# Altium schematic sheet Light Sensor Node.SchDoc
size A4
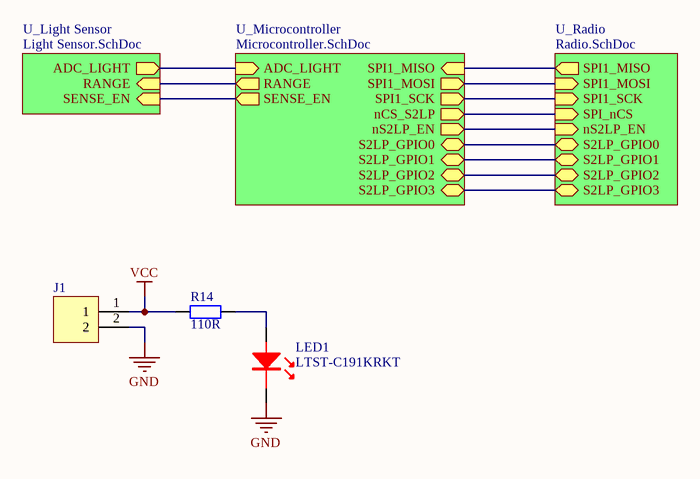
[diagram p0: Light Sensor Node.SchDoc]

## Parts
J1  22-05-3021  [MOLEX_22-05-3021]  (value not drawn)
LED1  LTST-C191KRKT  [LITEON_LTST-C191KRKT]
R14  110R  [R0603]

## Sub-sheets
U_Light Sensor = Light Sensor.SchDoc: ADC_LIGHT (out), RANGE (in), SENSE_EN (in)
U_Microcontroller = Microcontroller.SchDoc: ADC_LIGHT (in), RANGE (out), SPI1_SCK (out), SPI1_MISO (in), SPI1_MOSI (out), nCS_S2LP (out), nS2LP_EN (out), SENSE_EN (out), S2LP_GPIO2 (bidir), S2LP_GPIO1 (bidir), S2LP_GPIO0 (bidir), S2LP_GPIO3 (bidir)
U_Radio = Radio.SchDoc: SPI1_SCK (in), SPI1_MISO (out), SPI1_MOSI (in), SPI_nCS (in), nS2LP_EN (in), S2LP_GPIO1 (bidir), S2LP_GPIO2 (bidir), S2LP_GPIO3 (bidir), S2LP_GPIO0 (bidir)

## Nets
GND: J1.2 LED1.K
VCC: J1.1 R14.1
NetLED1_A: LED1.A R14.2
(unnamed): sheet U_Microcontroller/ADC_LIGHT, sheet U_Light Sensor/ADC_LIGHT
(unnamed): sheet U_Microcontroller/RANGE, sheet U_Light Sensor/RANGE
(unnamed): sheet U_Microcontroller/SPI1_SCK, sheet U_Radio/SPI1_SCK
(unnamed): sheet U_Microcontroller/SPI1_MISO, sheet U_Radio/SPI1_MISO
(unnamed): sheet U_Microcontroller/SPI1_MOSI, sheet U_Radio/SPI1_MOSI
(unnamed): sheet U_Microcontroller/nCS_S2LP, sheet U_Radio/SPI_nCS
(unnamed): sheet U_Microcontroller/nS2LP_EN, sheet U_Radio/nS2LP_EN
(unnamed): sheet U_Microcontroller/SENSE_EN, sheet U_Light Sensor/SENSE_EN
(unnamed): sheet U_Microcontroller/S2LP_GPIO2, sheet U_Radio/S2LP_GPIO2
(unnamed): sheet U_Microcontroller/S2LP_GPIO1, sheet U_Radio/S2LP_GPIO1
(unnamed): sheet U_Microcontroller/S2LP_GPIO0, sheet U_Radio/S2LP_GPIO0
(unnamed): sheet U_Microcontroller/S2LP_GPIO3, sheet U_Radio/S2LP_GPIO3

## Library data of the parts
J1 = 2WAY: Manufacturer: Molex; Manufacturer Part Number: 22-05-3021
LED1 = LED_Red: Manufacturer: Lite On; Manufacturer Part Number: LTST-C191KRKT
R14 = RES: Manufacturer: Yageo; Manufacturer Part Number: RC0603FR-07110RL; Footprint: *